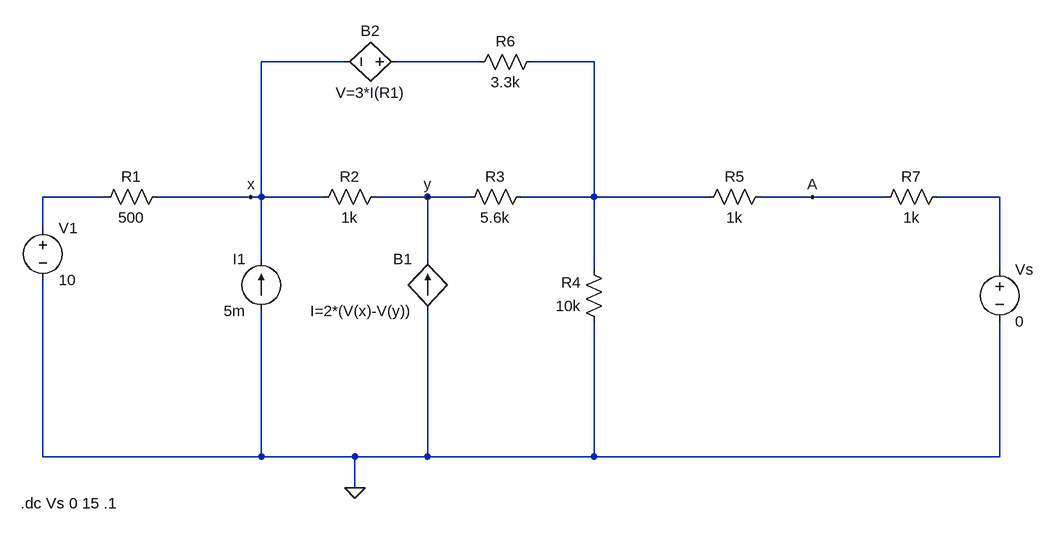
[diagram p0: schematic Task-2(IV)_22101008.asc.asc]
Task-2(IV)_22101008.asc.asc, the LTspice schematic file:
Version 4
SHEET 1 1432 680
WIRE 368 -96 240 -96
WIRE 576 -96 448 -96
WIRE 752 -96 656 -96
WIRE 0 112 -96 112
WIRE 224 112 80 112
WIRE 240 112 240 -96
WIRE 240 112 224 112
WIRE 336 112 240 112
WIRE 496 112 416 112
WIRE 560 112 496 112
WIRE 752 112 752 -96
WIRE 752 112 640 112
WIRE 928 112 752 112
WIRE 1088 112 1008 112
WIRE 1200 112 1088 112
WIRE 1376 112 1280 112
WIRE -96 160 -96 112
WIRE 240 208 240 112
WIRE 496 208 496 112
WIRE 752 224 752 112
WIRE 1376 224 1376 112
WIRE -96 512 -96 240
WIRE 240 512 240 288
WIRE 240 512 -96 512
WIRE 384 512 240 512
WIRE 496 512 496 288
WIRE 496 512 384 512
WIRE 752 512 752 304
WIRE 752 512 496 512
WIRE 1376 512 1376 304
WIRE 1376 512 752 512
WIRE 384 560 384 512
FLAG 224 112 x
FLAG 496 112 y
FLAG 384 560 0
FLAG 1088 112 A
SYMBOL res 432 96 R90
WINDOW 0 0 56 VBottom 2
WINDOW 3 32 56 VTop 2
SYMATTR InstName R2
SYMATTR Value 1k
SYMBOL res 656 96 R90
WINDOW 0 0 56 VBottom 2
WINDOW 3 32 56 VTop 2
SYMATTR InstName R3
SYMATTR Value 5.6k
SYMBOL res 768 320 R180
WINDOW 0 36 76 Left 2
WINDOW 3 36 40 Left 2
SYMATTR InstName R4
SYMATTR Value 10k
SYMBOL res 560 -80 R270
WINDOW 0 32 56 VTop 2
WINDOW 3 0 56 VBottom 2
SYMATTR InstName R6
SYMATTR Value 3.3k
SYMBOL bi 496 288 R180
WINDOW 0 24 80 Left 2
WINDOW 3 24 0 Left 2
SYMATTR InstName B1
SYMATTR Value I=2*(V(x)-V(y))
SYMBOL bv 464 -96 R90
WINDOW 0 -32 56 VBottom 2
WINDOW 3 32 56 VTop 2
SYMATTR InstName B2
SYMATTR Value V=3*I(R1)
SYMBOL res 96 96 R90
WINDOW 0 0 56 VBottom 2
WINDOW 3 32 56 VTop 2
SYMATTR InstName R1
SYMATTR Value 500
SYMBOL voltage -96 144 R0
SYMATTR InstName V1
SYMATTR Value 10
SYMBOL res 1024 96 R90
WINDOW 0 0 56 VBottom 2
WINDOW 3 32 56 VTop 2
SYMATTR InstName R5
SYMATTR Value 1k
SYMBOL current 240 288 R180
WINDOW 0 24 80 Left 2
WINDOW 3 24 0 Left 2
SYMATTR InstName I1
SYMATTR Value 5m
SYMBOL res 1296 96 R90
WINDOW 0 0 56 VBottom 2
WINDOW 3 32 56 VTop 2
SYMATTR InstName R7
SYMATTR Value 1k
SYMBOL voltage 1376 208 R0
WINDOW 123 0 0 Left 0
WINDOW 39 0 0 Left 0
SYMATTR InstName Vs
SYMATTR Value 0
TEXT -130 584 Left 2 !.dc Vs 0 15 .1

The netlist it stands for:
* Task-2(IV)_22101008.asc.asc
R2 y x 1k
R3 N002 y 5.6k
R4 0 N002 10k
R6 N001 N002 3.3k
B1 0 y I=2*(V(x)-V(y))
B2 N001 x V=3*I(R1)
R1 x N003 500
V1 N003 0 10
R5 A N002 1k
I1 0 x 5m
R7 N004 A 1k
Vs N004 0 0
.dc Vs 0 15 .1
.backanno
.end